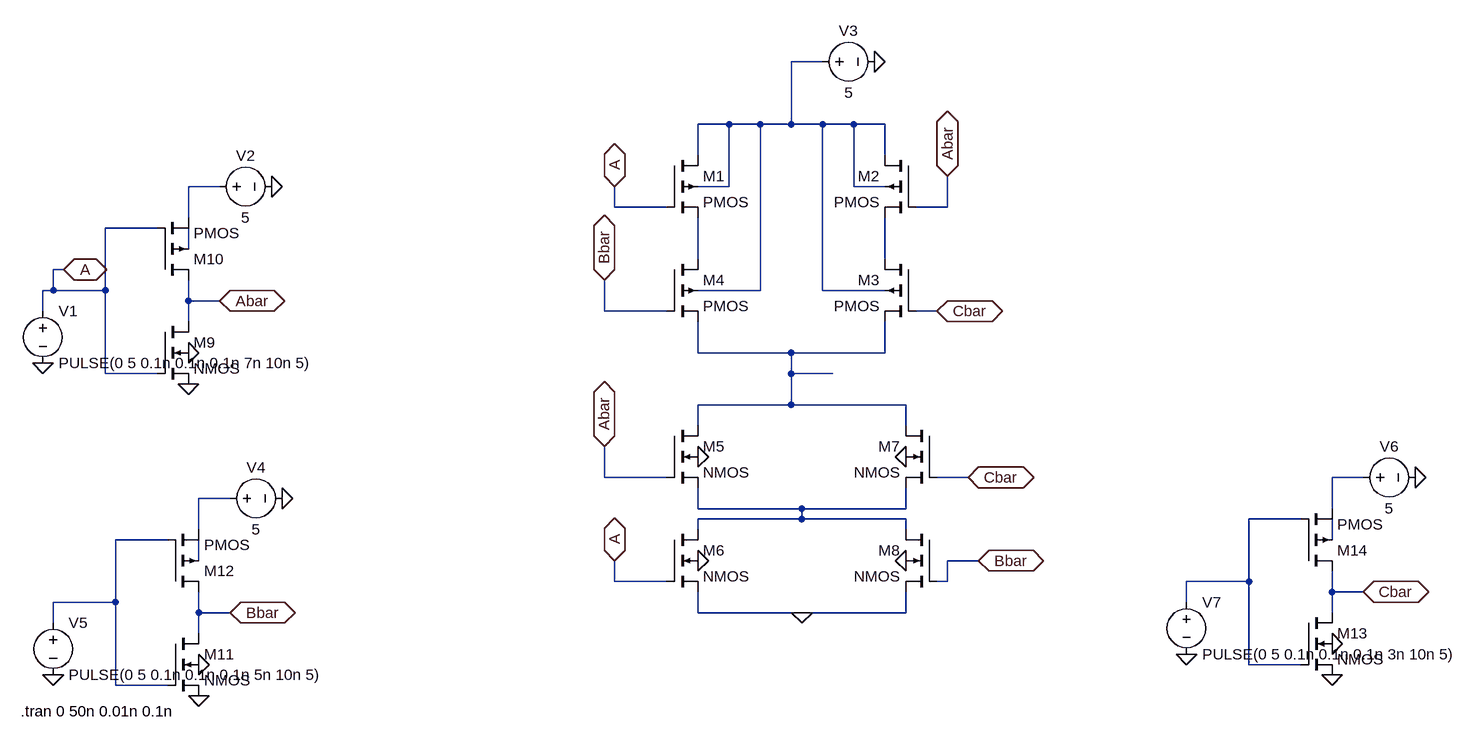
[diagram p0: schematic static.asc]
static.asc, the LTspice schematic file:
Version 4
SHEET 1 1212 728
WIRE 176 -368 128 -368
WIRE 32 -272 -16 -272
WIRE 80 -272 32 -272
WIRE 128 -272 128 -368
WIRE 128 -272 80 -272
WIRE 176 -272 128 -272
WIRE 224 -272 176 -272
WIRE 272 -272 224 -272
WIRE -16 -224 -16 -272
WIRE 272 -224 272 -272
WIRE -752 -176 -800 -176
WIRE 32 -176 32 -272
WIRE 32 -176 -16 -176
WIRE 224 -176 224 -272
WIRE 272 -176 224 -176
WIRE -144 -144 -144 -176
WIRE -64 -144 -144 -144
WIRE 368 -144 368 -192
WIRE 368 -144 320 -144
WIRE -800 -128 -800 -176
WIRE -848 -112 -928 -112
WIRE -800 -80 -800 -112
WIRE -16 -64 -16 -128
WIRE 272 -64 272 -128
WIRE -992 -48 -1008 -48
WIRE -1008 -16 -1008 -48
WIRE -1008 -16 -1024 -16
WIRE -928 -16 -928 -112
WIRE -928 -16 -1008 -16
WIRE 80 -16 80 -272
WIRE 80 -16 -16 -16
WIRE 176 -16 176 -272
WIRE 272 -16 176 -16
WIRE -800 0 -800 -32
WIRE -752 0 -800 0
WIRE -1024 16 -1024 -16
WIRE -160 16 -160 -32
WIRE -64 16 -160 16
WIRE 352 16 320 16
WIRE -800 32 -800 0
WIRE -16 80 -16 32
WIRE 128 80 -16 80
WIRE 272 80 272 32
WIRE 272 80 128 80
WIRE -928 112 -928 -16
WIRE -848 112 -928 112
WIRE 128 112 128 80
WIRE 192 112 128 112
WIRE 128 160 128 112
WIRE 128 160 -16 160
WIRE 304 160 128 160
WIRE -16 192 -16 160
WIRE 304 192 304 160
WIRE -160 272 -160 224
WIRE -64 272 -160 272
WIRE 400 272 352 272
WIRE 1008 272 960 272
WIRE -736 304 -784 304
WIRE -16 320 -16 288
WIRE 144 320 -16 320
WIRE 304 320 304 288
WIRE 304 320 144 320
WIRE 960 320 960 272
WIRE 144 336 144 320
WIRE 144 336 -16 336
WIRE 304 336 144 336
WIRE 912 336 832 336
WIRE -784 352 -784 304
WIRE -16 352 -16 336
WIRE 304 352 304 336
WIRE -832 368 -912 368
WIRE 960 368 960 336
WIRE -784 400 -784 368
WIRE 416 400 368 400
WIRE -144 432 -144 400
WIRE -64 432 -144 432
WIRE 368 432 368 400
WIRE 368 432 352 432
WIRE 832 432 832 336
WIRE 832 432 736 432
WIRE 960 448 960 416
WIRE 1008 448 960 448
WIRE -912 464 -912 368
WIRE -912 464 -1008 464
WIRE 736 464 736 432
WIRE -784 480 -784 448
WIRE -736 480 -784 480
WIRE -16 480 -16 448
WIRE 144 480 -16 480
WIRE 304 480 304 448
WIRE 304 480 144 480
WIRE 960 480 960 448
WIRE -1008 496 -1008 464
WIRE -784 512 -784 480
WIRE 832 560 832 432
WIRE 912 560 832 560
WIRE -912 592 -912 464
WIRE -832 592 -912 592
FLAG -16 240 0
FLAG -16 400 0
FLAG 304 400 0
FLAG 304 240 0
FLAG -800 128 0
FLAG -800 80 0
FLAG -1024 96 0
FLAG 256 -368 0
FLAG -672 -176 0
FLAG -784 608 0
FLAG -784 560 0
FLAG -1008 576 0
FLAG -656 304 0
FLAG 960 576 0
FLAG 960 528 0
FLAG 736 544 0
FLAG 1088 272 0
FLAG -992 -48 A
IOPIN -992 -48 BiDir
FLAG -144 -176 A
IOPIN -144 -176 BiDir
FLAG -144 400 A
IOPIN -144 400 BiDir
FLAG -752 0 Abar
IOPIN -752 0 BiDir
FLAG -160 224 Abar
IOPIN -160 224 BiDir
FLAG 368 -192 Abar
IOPIN 368 -192 BiDir
FLAG 144 480 0
FLAG -736 480 Bbar
IOPIN -736 480 BiDir
FLAG -160 -32 Bbar
IOPIN -160 -32 BiDir
FLAG 416 400 Bbar
IOPIN 416 400 BiDir
FLAG 1008 448 Cbar
IOPIN 1008 448 BiDir
FLAG 352 16 Cbar
IOPIN 352 16 BiDir
FLAG 400 272 Cbar
IOPIN 400 272 BiDir
SYMBOL pmos4 -64 -224 R0
SYMATTR InstName M1
SYMBOL pmos4 320 -224 M0
SYMATTR InstName M2
SYMBOL pmos4 320 -64 M0
SYMATTR InstName M3
SYMBOL pmos4 -64 -64 R0
SYMATTR InstName M4
SYMBOL nmos4 -64 192 R0
SYMATTR InstName M5
SYMBOL nmos4 -64 352 R0
SYMATTR InstName M6
SYMBOL nmos4 352 192 M0
SYMATTR InstName M7
SYMBOL nmos4 352 352 M0
SYMATTR InstName M8
SYMBOL nmos4 -848 32 R0
SYMATTR InstName M9
SYMBOL pmos4 -848 -32 M180
SYMATTR InstName M10
SYMBOL voltage -768 -176 M90
WINDOW 0 -32 56 VBottom 2
WINDOW 3 32 56 VTop 2
WINDOW 123 0 0 Left 2
WINDOW 39 0 0 Left 2
SYMATTR InstName V2
SYMATTR Value 5
SYMBOL voltage -1024 0 R0
WINDOW 123 0 0 Left 2
WINDOW 39 0 0 Left 2
SYMATTR InstName V1
SYMATTR Value PULSE(0 5 0.1n 0.1n 0.1n 7n 10n 5)
SYMBOL voltage 160 -368 M90
WINDOW 0 -32 56 VBottom 2
WINDOW 3 32 56 VTop 2
WINDOW 123 0 0 Left 2
WINDOW 39 0 0 Left 2
SYMATTR InstName V3
SYMATTR Value 5
SYMBOL nmos4 -832 512 R0
SYMATTR InstName M11
SYMBOL pmos4 -832 448 M180
SYMATTR InstName M12
SYMBOL voltage -752 304 M90
WINDOW 0 -32 56 VBottom 2
WINDOW 3 32 56 VTop 2
WINDOW 123 0 0 Left 2
WINDOW 39 0 0 Left 2
SYMATTR InstName V4
SYMATTR Value 5
SYMBOL voltage -1008 480 R0
WINDOW 123 0 0 Left 2
WINDOW 39 0 0 Left 2
SYMATTR InstName V5
SYMATTR Value PULSE(0 5 0.1n 0.1n 0.1n 5n 10n 5)
SYMBOL nmos4 912 480 R0
SYMATTR InstName M13
SYMBOL pmos4 912 416 M180
SYMATTR InstName M14
SYMBOL voltage 992 272 M90
WINDOW 0 -32 56 VBottom 2
WINDOW 3 32 56 VTop 2
WINDOW 123 0 0 Left 2
WINDOW 39 0 0 Left 2
SYMATTR InstName V6
SYMATTR Value 5
SYMBOL voltage 736 448 R0
WINDOW 123 0 0 Left 2
WINDOW 39 0 0 Left 2
SYMATTR InstName V7
SYMATTR Value PULSE(0 5 0.1n 0.1n 0.1n 3n 10n 5)
TEXT -1058 632 Left 2 !.tran 0 50n 0.01n 0.1n

The netlist it stands for:
* static.asc
M1 N001 A N004 N001 PMOS
M2 N001 Abar N005 N001 PMOS
M3 N005 Cbar N006 N001 PMOS
M4 N004 Bbar N006 N001 PMOS
M5 N006 Abar N009 0 NMOS
M6 N009 A 0 0 NMOS
M7 N006 Cbar N009 0 NMOS
M8 N009 Bbar 0 0 NMOS
M9 Abar A 0 0 NMOS
M10 Abar A N002 N003 PMOS
V2 N002 0 5
V1 A 0 PULSE(0 5 0.1n 0.1n 0.1n 7n 10n 5)
V3 N001 0 5
M11 Bbar N011 0 0 NMOS
M12 Bbar N011 N008 N013 PMOS
V4 N008 0 5
V5 N011 0 PULSE(0 5 0.1n 0.1n 0.1n 5n 10n 5)
M13 Cbar N010 0 0 NMOS
M14 Cbar N010 N007 N012 PMOS
V6 N007 0 5
V7 N010 0 PULSE(0 5 0.1n 0.1n 0.1n 3n 10n 5)
.model NMOS NMOS
.model PMOS PMOS
.lib standard.mos
.tran 0 50n 0.01n 0.1n
.backanno
.end

* Results of the author's LTspice run, read from the files saved beside the schematic
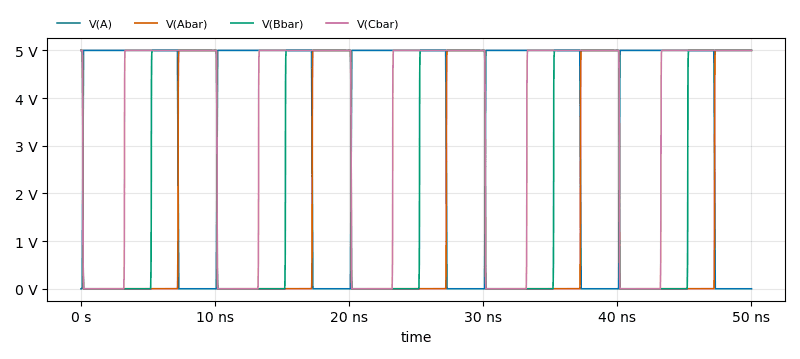
[diagram p1: Transient Analysis of static.asc, plotted from the saved traces]
* Transient Analysis, 1 run:
*   V(A): min 0 V, max 5 V, average 3.551 V, rms 4.204 V, last 0 V
*   V(Abar): min 0 V, max 5 V, average 1.45 V, rms 2.685 V, last 5 V
*   V(Bbar): min 0 V, max 5 V, average 2.45 V, rms 3.494 V, last 5 V
*   V(Cbar): min 0 V, max 5 V, average 3.45 V, rms 4.149 V, last 5 V